# EAGLE schematic Stromsenke Board (EAGLE 8.3.2)

## Sheet 1 of 2
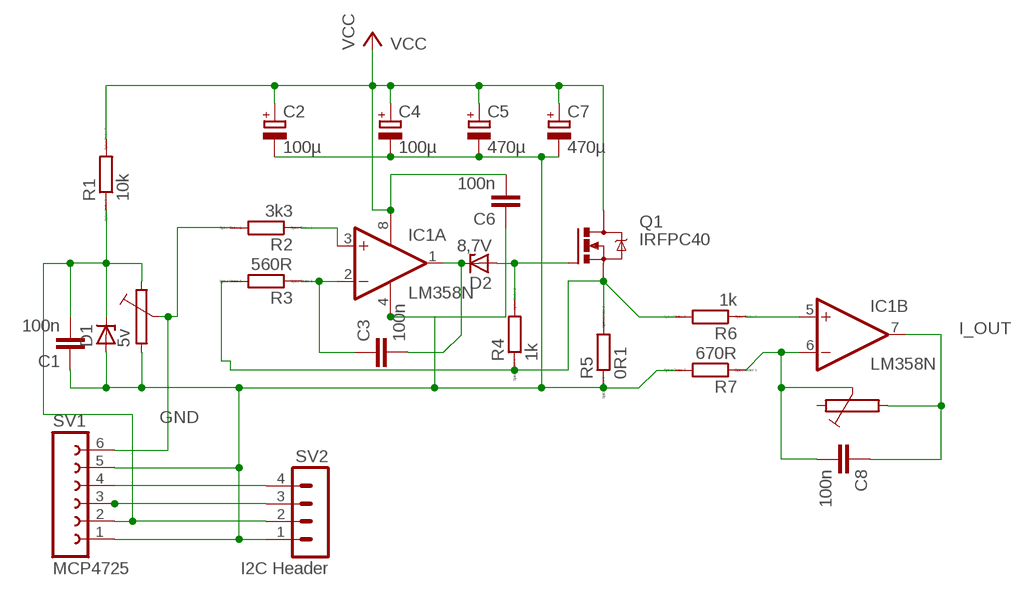
[diagram p0: schematic, sheet 1]

### Parts
C1  100n  C5/2.5  [C5B2.5]
C2  100µ  CPOL-EUE3.5-8  [E3,5-8]
C3  100n  C5/2.5  [C5B2.5]
C4  100µ  CPOL-EUE3.5-8  [E3,5-8]
C5  470µ  CPOL-EUE3.5-10  [E3,5-10]
C6  100n  C5/2.5  [C5B2.5]
C7  470µ  CPOL-EUE3.5-10  [E3,5-10]
C8  100n  C5/2.5  [C5B2.5]
D1  5v  ZENER-DIODEC1702-15  [C1702-15]
D2  8,7V  ZENER-DIODEC1702-15  [C1702-15]
IC1  LM358N  [DIL08]
Q1  IRFPC40  [TO247BV]
R1  10k  R0207/10  [0207/10]
R2  3k3  R0207/10  [0207/10]
R3  560R  R0207/10  [0207/10]
R4  1k  R0207/10  [0207/10]
R5  0R1  R0207/10  [0207/10]
R6  1k  R0207/10  [0207/10]
R7  670R  R0207/10  [0207/10]
SV1  MCP4725  FE06-1  [FE06]
SV2  I2C Header  MA04-1  [MA04-1]

### Nets
GND: C1.1 C2.- C4.- C5.- C6.1 C7.- D1.A IC1.4(P:V-) R5.1 R7.2 SV1.1 SV1.5 SV2.1
I_OUT: C8.1 IC1.7(B:OUT)
N$1: D2.A Q1.G R4.2
N$2: IC1.3(A:+IN) R2.1
N$3: SV1.3 SV2.3
N$4: C1.2 D1.C R1.1 SV1.2 SV2.2
N$5: Q1.S R3.2 R4.1 R5.2 R6.2
N$6: C3.2 D2.C IC1.1(A:OUT)
N$7: IC1.5(B:+IN) R6.1
N$9: C3.1 IC1.2(A:-IN) R3.1
N$10: C8.2 IC1.6(B:-IN) R7.1
N$11: R2.2 SV1.6
N$12: SV1.4 SV2.4
VCC: C2.+ C4.+ C5.+ C6.2 C7.+ IC1.8(P:V+) Q1.D R1.2

## Sheet 2 of 2

## Library data of the parts
C1 C3 C6 C8 = capacitor-wima:C: CAPACITOR naming: grid - package width
C2 C4 C5 C7 = resistor:CPOL-EU: POLARIZED CAPACITOR, European symbol
D1 D2 = diode:ZENER-DIODE: Z-Diode
IC1 = linear:LM358: OP AMP also LM158; LM258; LM2904 Source: http://cache.national.com/ds/LM/LM158.pdf
Q1 = transistor-power:IRFPC40: N-CHANNEL MOS FET
R1-R7 = eagle-ltspice:R: RESISTOR, European symbol; SPICEMODEL: NONE; SPICEPREFIX: R
SV1 = con-lsta:FE06-1: FEMALE HEADER; OC_FARNELL: unknown; OC_NEWARK: unknown
SV2 = con-lstb:MA04-1: PIN HEADER; OC_FARNELL: unknown; OC_NEWARK: unknown